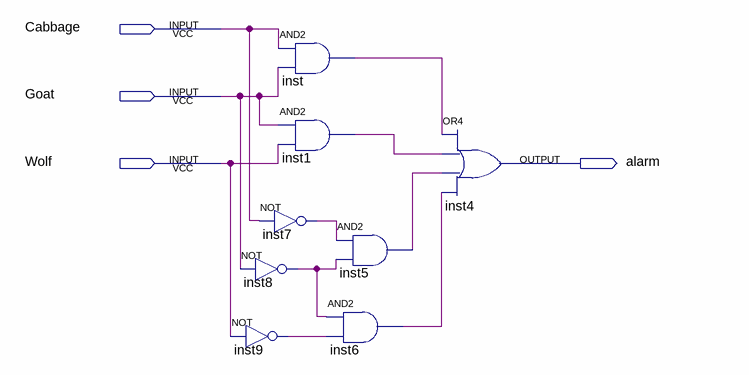
[diagram p0: schematic sheet]
// Quartus schematic lab2step2.bdf as structural Verilog: 8 symbols, 4 pins
module lab2step2 (
  input  Cabbage,
  input  Goat,
  input  Wolf,
  output alarm
);

  wire inst1_out, inst5_out, inst6_out, inst7_out, inst8_out, inst9_out, inst_out;

  and inst (inst_out, Cabbage, Goat);
  and inst1 (inst1_out, Goat, Wolf);
  not inst7 (inst7_out, Cabbage);
  not inst8 (inst8_out, Goat);
  not inst9 (inst9_out, Wolf);
  and inst5 (inst5_out, inst7_out, inst8_out);
  and inst6 (inst6_out, inst8_out, inst9_out);
  or inst4 (alarm, inst_out, inst1_out, inst5_out, inst6_out);
endmodule
